# Altium schematic sheet 02_Hum_Temp_Sensor.SchDoc: Hum_Temp_Sensor
size A4; SheetNumber: 3; SheetTotal: 7; Project_Name: Monitoring_Control_Circuit; Designer: Hao Thai; Version: 1.0
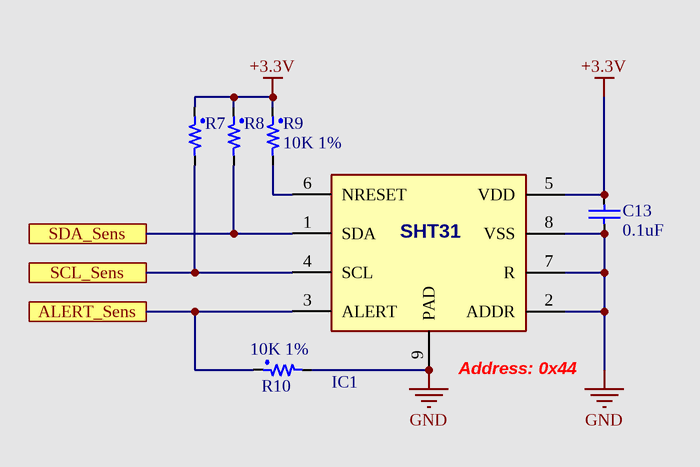
[diagram p0: 02_Hum_Temp_Sensor.SchDoc]

## Parts
C13  0.1uF  [C0603 (1608 metric)]
IC1  SHT31A-DIS-B10kS  [SHT31]  (value not drawn)
R7  10K 1%  [R0603 (1608 Metric)]  (value not drawn)
R8  10K 1%  [R0603 (1608 Metric)]  (value not drawn)
R9  10K 1%  [R0603 (1608 Metric)]
R10  10K 1%  [R0603 (1608 Metric)]

## Ports
ALERT_Sens, SCL_Sens, SDA_Sens

## Nets
+3.3V: C13.2 IC1.5(VDD) R7.1 R8.1 R9.1
GND: C13.1 IC1.2(ADDR) IC1.7(R) IC1.8(VSS) IC1.9(PAD) R10.2
ALERT_Sens: IC1.3(ALERT) R10.1 ; port ALERT_Sens
SCL_Sens: IC1.4(SCL) R7.2 ; port SCL_Sens
SDA_Sens: IC1.1(SDA) R8.2 ; port SDA_Sens
NetIC1_6: IC1.6(NRESET) R9.2

## Notes on the sheet
- (near IC1) Address: 0x44
- Document Title:
- BK Maker Club
- Size:
- Project Name:
- A4
- Designer:
- Reviewer:
- Revision:
- Sheet
- of
- Nguyen Xien Street
- Long Thanh My Ward, Thu Duc District
- Ho Chi Minh City
- Date:
- File:
- (in symbol SHT31A-DIS-B10kS) SHT31

## Library data of the parts
C13 = CC0603KRX7R9BB104: Multilayer Ceramic Capacitors MLCC - SMD/SMT 0.1uF 50V X7R +/-10% 0603; Mfr: Yageo; Tolerance: 10%; Mfr Part Number: CC0603KRX7R9BB104; Supplier Part Number 1: 603-CC603KRX7R9BB104; Supplier 1: Mouser; Value: 0.1uF; Dielectric: X7R; Case: 0603 (1608 metric); Voltage: 50V
IC1 = SHT31A-DIS-B10kS: Board Mount Humidity Sensors RH/ T Sensor, Automotive certified; Mfr: Sensirion; Datasheet Link: http://www.farnell.com/datasheets/2915263.pdf; Height: 1mm; Mfr Part Number: SHT31A-DIS-B10kS; Supplier Part Number 1: 403-SHT31ADIS-B10KS; Supplier 1: Mouser; Arrow Part Number: SHT31A-DIS-B10KS; Arrow Price/Stock: https://www.arrow.com/en/products/sht31a-dis-b10ks/sensirion-ag?region=nac
R7-R10 = RC0603FR-0710KL: Thick Film Resistors - SMD 10K OHM 1% Case 0603; Mfr: Yageo; Value: 10K; Supplier 1: Mouser; Supplier Part Number 1: 603-RC0603FR-0710KL; Mfr Part Number: RC0603FR-0710KL; Case: 0603 (1608 metric); Tolerance: 1%